# EAGLE design arpie_max (EAGLE 5.10)

## Sheet 1 of 5
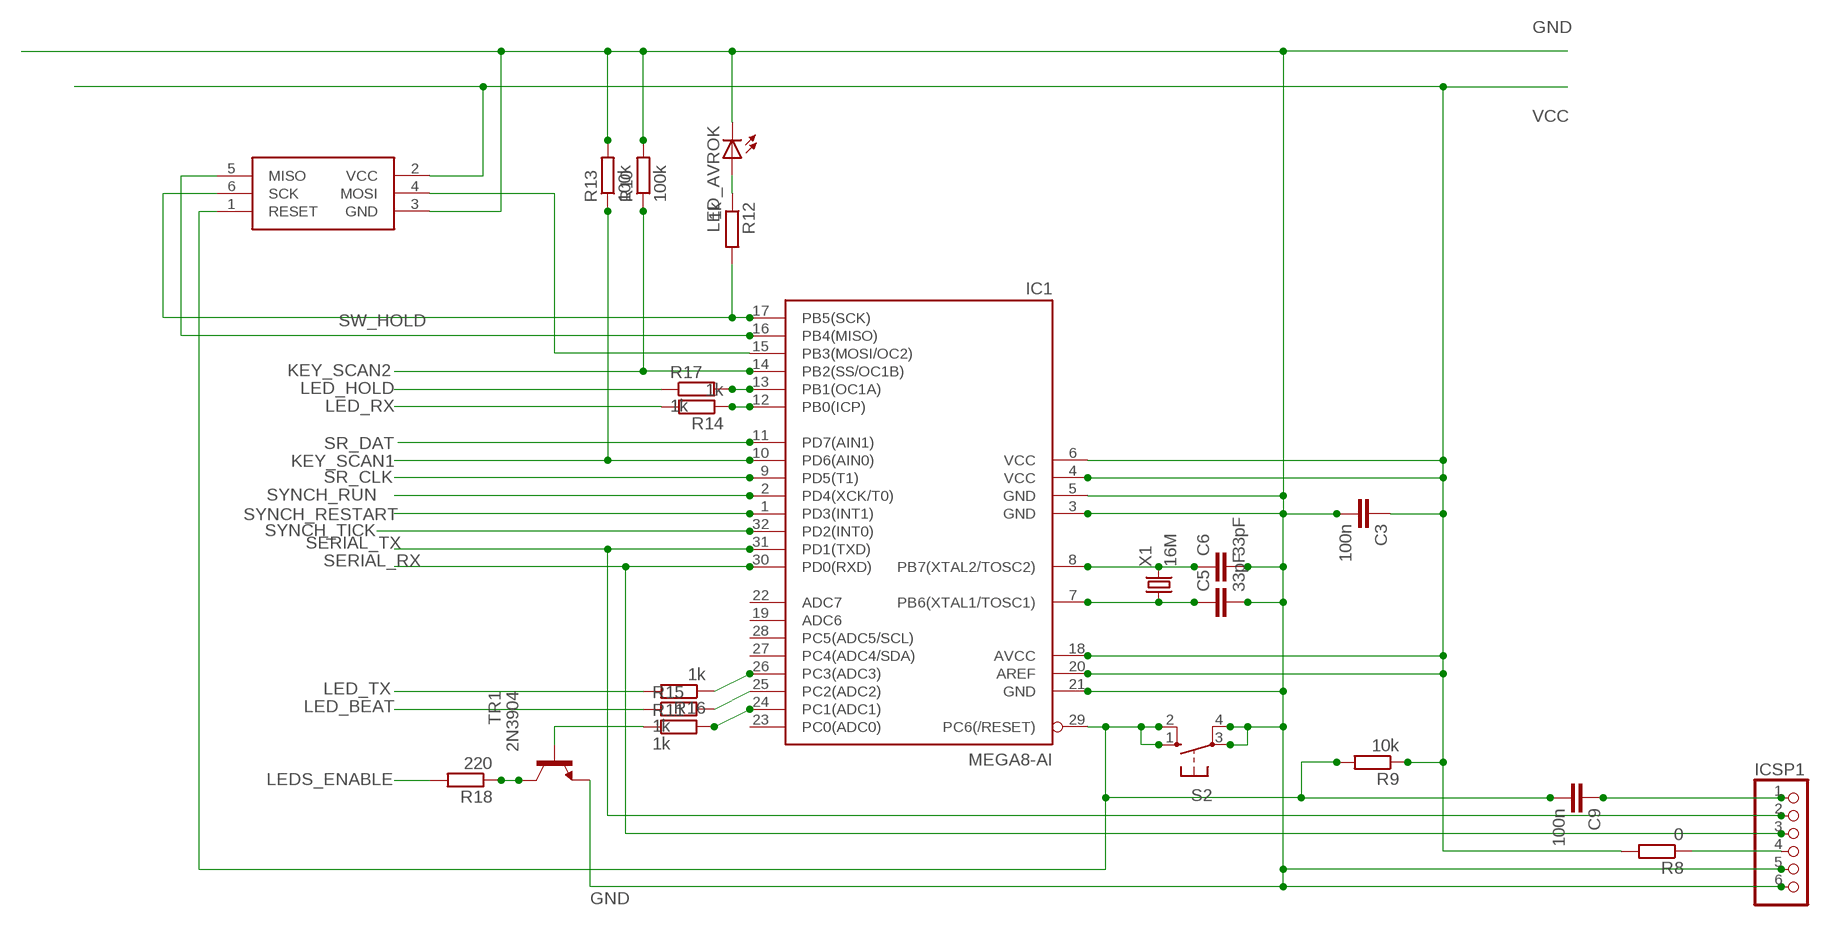
[diagram p0: schematic, sheet 1]

### Parts
C3  100n  C-EUC0805  [C0805]
C5  33pF  C-EUC0805  [C0805]
C6  33pF  C-EUC0805  [C0805]
C9  100n  C-EUC0805  [C0805]
IC1  MEGA8-AI  [TQFP32-08]
ICSP1  PINHD-1X6  [1X06]
LED_AVROK  LED3MM  [LED3MM]
R8  0  R-EU_R0805  [R0805]
R9  10k  R-EU_R0805  [R0805]
R10  100k  R-EU_R0805  [R0805]
R11  1k  R-EU_R0805  [R0805]
R12  1k  R-EU_R0805  [R0805]
R13  100k  R-EU_R0805  [R0805]
R14  1k  R-EU_R0805  [R0805]
R15  1k  R-EU_R0805  [R0805]
R16  1k  R-EU_R0805  [R0805]
R17  1k  R-EU_R0805  [R0805]
R18  220  R-EU_R0805  [R0805]
S2  10-XX  [B3F-10XX]
TR1  2N3904  MMBT3904LT1-NPN-SOT23-BEC  [SOT23-BEC]
U$1  TAG_CONN_AVR  [TC2030-MCP-NL]
X1  16M  CRYSTALHC49S  [HC49/S]

### Nets
GND: C3.2 C5.2 C6.2 IC1.3(GND) IC1.5(GND) IC1.21(GND) ICSP1.5 ICSP1.6 LED_AVROK.K(C) R10.2 R13.2 S2.3(P) S2.4(P1) TR1.E U$1.3(GND) ; also sheet 2,3,4,5
KEY_SCAN1: IC1.10(PD6(AIN0)) R13.1 ; also sheet 2
KEY_SCAN2: IC1.14(PB2(SS/OC1B)) R10.1 ; also sheet 2
LED_BEAT: R15.1 ; also sheet 2
LED_HOLD: R17.1 ; also sheet 2
LED_RX: R14.2 ; also sheet 2
LED_TX: R16.2 ; also sheet 2
LEDS_ENABLE: R18.2 ; also sheet 2
MOSI: IC1.15(PB3(MOSI/OC2)) U$1.4(MOSI)
N$4: R11.1 TR1.B
N$6: IC1.25(PC2(ADC2)) R15.2
N$9: C9.1 ICSP1.1
N$14: R18.1 TR1.C
N$15: ICSP1.4 R8.1
N$35: IC1.26(PC3(ADC3)) R16.1
N$36: C6.1 IC1.8(PB7(XTAL2/TOSC2)) X1.2
N$37: C5.1 IC1.7(PB6(XTAL1/TOSC1)) X1.1
N$38: C9.2 IC1.29(PC6(/RESET)) R9.2 S2.1(S) S2.2(S1) U$1.1(RESET)
N$43: IC1.24(PC1(ADC1)) R11.2
N$44: IC1.12(PB0(ICP)) R14.1
N$50: LED_AVROK.A R12.1
N$55: IC1.13(PB1(OC1A)) R17.2
SCK: IC1.17(PB5(SCK)) R12.2 U$1.6(SCK)
SERIAL_RX: IC1.30(PD0(RXD)) ICSP1.3 ; also sheet 5
SERIAL_TX: IC1.31(PD1(TXD)) ICSP1.2 ; also sheet 5
SR_CLK: IC1.9(PD5(T1)) ; also sheet 2
SR_DAT: IC1.11(PD7(AIN1)) ; also sheet 2
SW_HOLD: IC1.16(PB4(MISO)) U$1.5(MISO) ; also sheet 2
SYNCH_RESTART: IC1.1(PD3(INT1)) ; also sheet 3
SYNCH_RUN: IC1.2(PD4(XCK/T0)) ; also sheet 3
SYNCH_TICK: IC1.32(PD2(INT0)) ; also sheet 3
VCC: C3.1 IC1.4(VCC) IC1.6(VCC) IC1.18(AVCC) IC1.20(AREF) R8.2 R9.1 U$1.2(VCC) ; also sheet 2,3,4,5
Unconnected: IC1.19(ADC6) IC1.22(ADC7) IC1.23(PC0(ADC0)) IC1.27(PC4(ADC4/SDA)) IC1.28(PC5(ADC5/SCL))

## Sheet 2 of 5
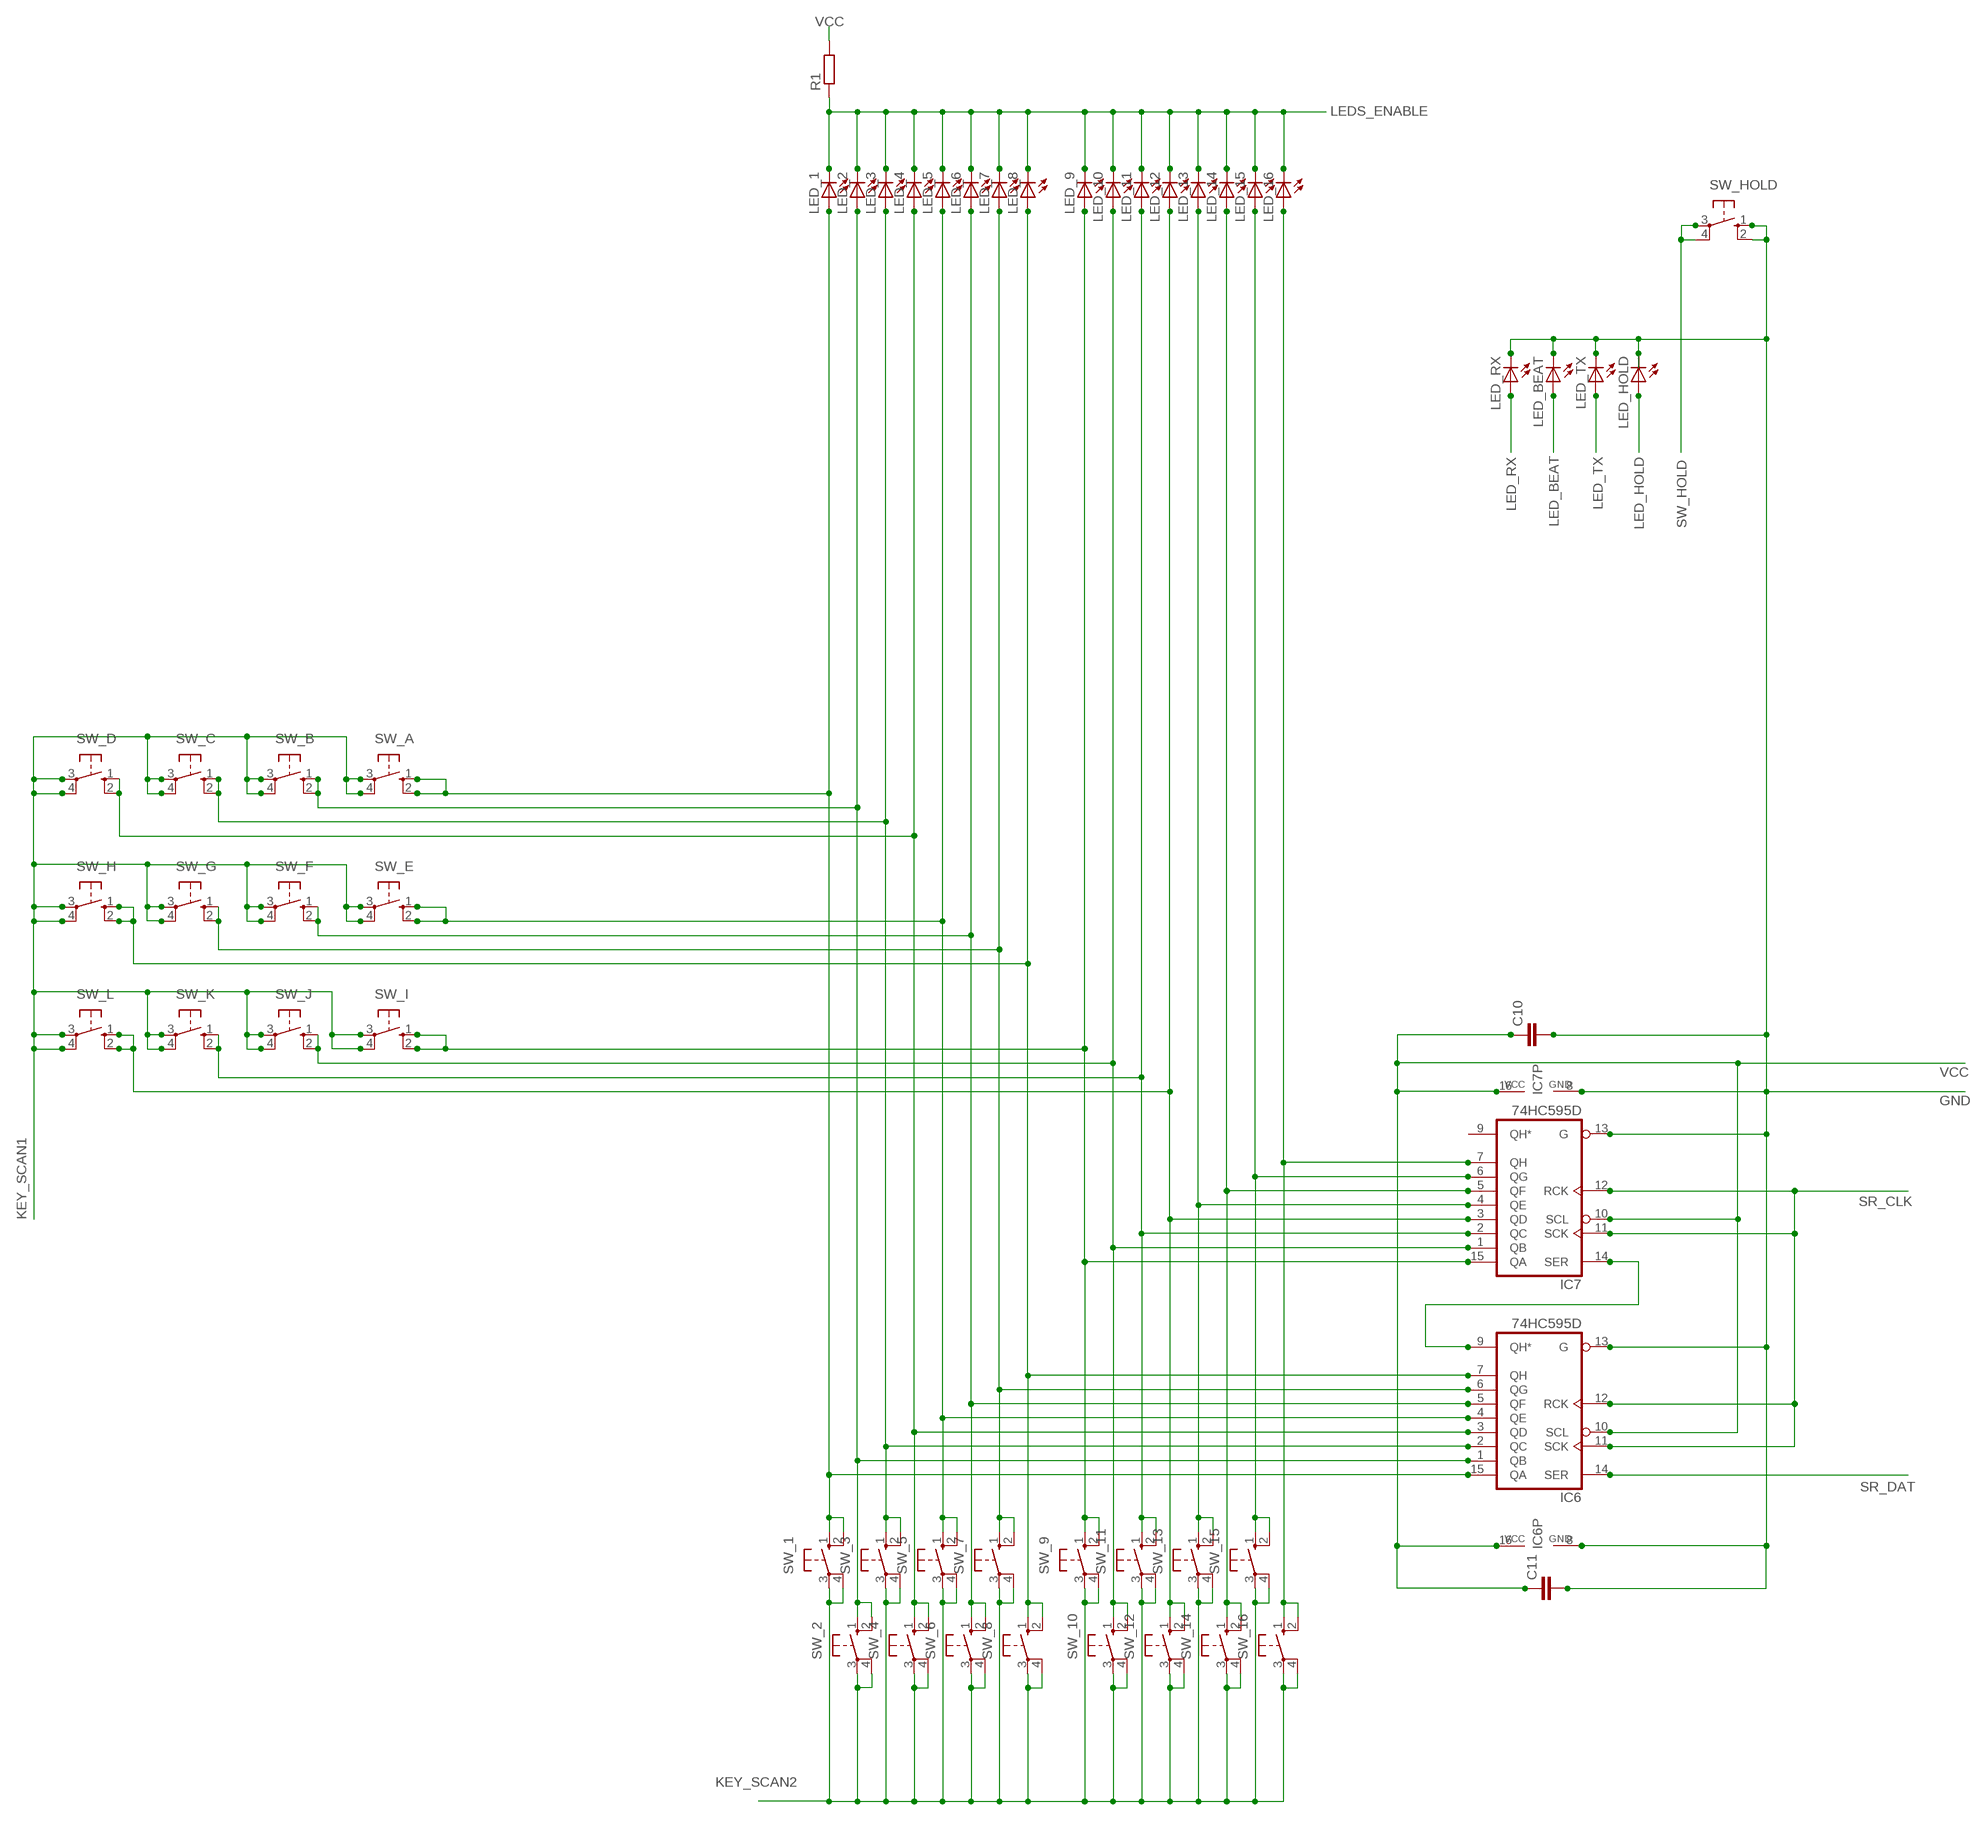
[diagram p1: schematic, sheet 2]

### Parts
C10  C-EUC0805  [C0805]
C11  C-EUC0805  [C0805]
IC6  74HC595D  [SO16]
IC7  74HC595D  [SO16]
LED_1  LED3MM  [LED3MM]
LED_2  LED3MM  [LED3MM]
LED_3  LED3MM  [LED3MM]
LED_4  LED3MM  [LED3MM]
LED_5  LED3MM  [LED3MM]
LED_6  LED3MM  [LED3MM]
LED_7  LED3MM  [LED3MM]
LED_8  LED3MM  [LED3MM]
LED_9  LED3MM  [LED3MM]
LED_10  LED3MM  [LED3MM]
LED_11  LED3MM  [LED3MM]
LED_12  LED3MM  [LED3MM]
LED_13  LED3MM  [LED3MM]
LED_14  LED3MM  [LED3MM]
LED_15  LED3MM  [LED3MM]
LED_16  LED3MM  [LED3MM]
LED_BEAT  LED3MM  [LED3MM]
LED_HOLD  LED3MM  [LED3MM]
LED_RX  LED3MM  [LED3MM]
LED_TX  LED3MM  [LED3MM]
R1  R-EU_R0805  [R0805]
SW_1  10-XX  [B3F-10XX]
SW_2  10-XX  [B3F-10XX]
SW_3  10-XX  [B3F-10XX]
SW_4  10-XX  [B3F-10XX]
SW_5  10-XX  [B3F-10XX]
SW_6  10-XX  [B3F-10XX]
SW_7  10-XX  [B3F-10XX]
SW_8  10-XX  [B3F-10XX]
SW_9  10-XX  [B3F-10XX]
SW_10  10-XX  [B3F-10XX]
SW_11  10-XX  [B3F-10XX]
SW_12  10-XX  [B3F-10XX]
SW_13  10-XX  [B3F-10XX]
SW_14  10-XX  [B3F-10XX]
SW_15  10-XX  [B3F-10XX]
SW_16  10-XX  [B3F-10XX]
SW_A  40-XX  [B3F-40XX]
SW_B  40-XX  [B3F-40XX]
SW_C  40-XX  [B3F-40XX]
SW_D  40-XX  [B3F-40XX]
SW_E  40-XX  [B3F-40XX]
SW_F  40-XX  [B3F-40XX]
SW_G  40-XX  [B3F-40XX]
SW_H  40-XX  [B3F-40XX]
SW_HOLD  40-XX  [B3F-40XX]
SW_I  40-XX  [B3F-40XX]
SW_J  40-XX  [B3F-40XX]
SW_K  40-XX  [B3F-40XX]
SW_L  40-XX  [B3F-40XX]

### Nets
GND: C10.2 C11.2 IC6.8(GND) IC6.13(G) IC7.8(GND) IC7.13(G) LED_BEAT.K(C) LED_HOLD.K(C) LED_RX.K(C) LED_TX.K(C) SW_HOLD.1(S) SW_HOLD.2(S1) ; also sheet 1,3,4,5
KEY_SCAN1: SW_A.3(P) SW_A.4(P1) SW_B.3(P) SW_B.4(P1) SW_C.3(P) SW_C.4(P1) SW_D.3(P) SW_D.4(P1) SW_E.3(P) SW_E.4(P1) SW_F.3(P) SW_F.4(P1) SW_G.3(P) SW_G.4(P1) SW_H.3(P) SW_H.4(P1) SW_I.3(P) SW_I.4(P1) SW_J.3(P) SW_J.4(P1) SW_K.3(P) SW_K.4(P1) SW_L.3(P) SW_L.4(P1) ; also sheet 1
KEY_SCAN2: SW_1.3(P) SW_1.4(P1) SW_2.3(P) SW_2.4(P1) SW_3.3(P) SW_3.4(P1) SW_4.3(P) SW_4.4(P1) SW_5.3(P) SW_5.4(P1) SW_6.3(P) SW_6.4(P1) SW_7.3(P) SW_7.4(P1) SW_8.3(P) SW_8.4(P1) SW_9.3(P) SW_9.4(P1) SW_10.3(P) SW_10.4(P1) SW_11.3(P) SW_11.4(P1) SW_12.3(P) SW_12.4(P1) SW_13.3(P) SW_13.4(P1) SW_14.3(P) SW_14.4(P1) SW_15.3(P) SW_15.4(P1) SW_16.3(P) SW_16.4(P1) ; also sheet 1
LED_BEAT: LED_BEAT.A ; also sheet 1
LED_HOLD: LED_HOLD.A ; also sheet 1
LED_RX: LED_RX.A ; also sheet 1
LED_TX: LED_TX.A ; also sheet 1
LEDS_ENABLE: LED_1.K(C) LED_2.K(C) LED_3.K(C) LED_4.K(C) LED_5.K(C) LED_6.K(C) LED_7.K(C) LED_8.K(C) LED_9.K(C) LED_10.K(C) LED_11.K(C) LED_12.K(C) LED_13.K(C) LED_14.K(C) LED_15.K(C) LED_16.K(C) R1.1 ; also sheet 1
N$17: IC6.15(QA) LED_1.A SW_1.1(S) SW_1.2(S1) SW_A.1(S) SW_A.2(S1)
N$20: IC6.1(QB) LED_2.A SW_2.1(S) SW_2.2(S1) SW_B.1(S) SW_B.2(S1)
N$21: IC6.2(QC) LED_3.A SW_3.1(S) SW_3.2(S1) SW_C.1(S) SW_C.2(S1)
N$22: IC6.3(QD) LED_4.A SW_4.1(S) SW_4.2(S1) SW_D.1(S) SW_D.2(S1)
N$23: IC6.4(QE) LED_5.A SW_5.1(S) SW_5.2(S1) SW_E.1(S) SW_E.2(S1)
N$24: IC6.5(QF) LED_6.A SW_6.1(S) SW_6.2(S1) SW_F.1(S) SW_F.2(S1)
N$25: IC6.6(QG) LED_7.A SW_7.1(S) SW_7.2(S1) SW_G.1(S) SW_G.2(S1)
N$26: IC6.7(QH) LED_8.A SW_8.1(S) SW_8.2(S1) SW_H.1(S) SW_H.2(S1)
N$27: IC7.15(QA) LED_9.A SW_9.1(S) SW_9.2(S1) SW_I.1(S) SW_I.2(S1)
N$28: IC7.1(QB) LED_10.A SW_10.1(S) SW_10.2(S1) SW_J.1(S) SW_J.2(S1)
N$29: IC7.3(QD) LED_12.A SW_12.1(S) SW_12.2(S1) SW_L.1(S) SW_L.2(S1)
N$30: IC7.2(QC) LED_11.A SW_11.1(S) SW_11.2(S1) SW_K.1(S) SW_K.2(S1)
N$31: IC6.9(QH*) IC7.14(SER)
N$32: IC7.4(QE) LED_13.A SW_13.1(S) SW_13.2(S1)
N$34: IC7.5(QF) LED_14.A SW_14.1(S) SW_14.2(S1)
N$39: IC7.6(QG) LED_15.A SW_15.1(S) SW_15.2(S1)
N$40: IC7.7(QH) LED_16.A SW_16.1(S) SW_16.2(S1)
SR_CLK: IC6.11(SCK) IC6.12(RCK) IC7.11(SCK) IC7.12(RCK) ; also sheet 1
SR_DAT: IC6.14(SER) ; also sheet 1
SW_HOLD: SW_HOLD.3(P) SW_HOLD.4(P1) ; also sheet 1
VCC: C10.1 C11.1 IC6.10(SCL) IC6.16(VCC) IC7.10(SCL) IC7.16(VCC) R1.2 ; also sheet 1,3,4,5
Unconnected: IC7.9(QH*)

## Sheet 3 of 5
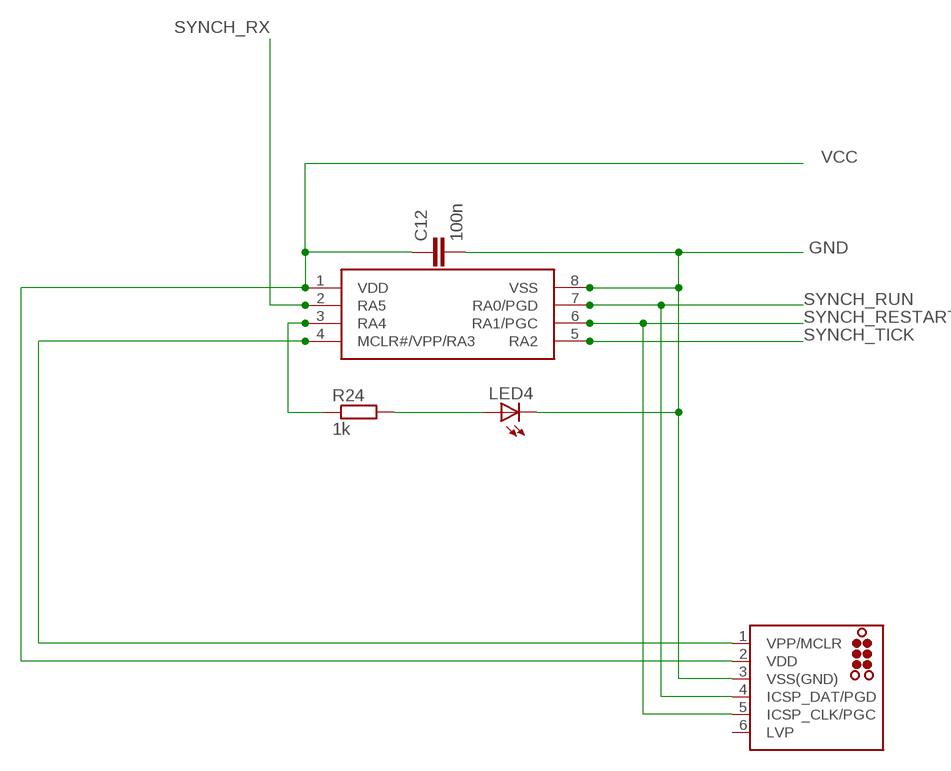
[diagram p2: schematic, sheet 3]

### Parts
C12  100n  C-EUC0805  [C0805]
IC9  PIC12F1822SO08  [SO08]
J1  TC2030-MCP-NL  [TC2030-MCP-NL]
LED4  LED3MM  [LED3MM]
R24  1k  R-EU_R0805  [R0805]

### Nets
GND: C12.2 IC9.8(VSS) J1.3(VSS(GND)) LED4.K(C) ; also sheet 1,2,4,5
N$1: LED4.A R24.2
N$58: IC9.3(RA4) R24.1
N$59: IC9.4(MCLR#/VPP/RA3) J1.1(VPP/MCLR)
SYNCH_RESTART: IC9.6(RA1/PGC) J1.5(ICSP_CLK/PGC) ; also sheet 1
SYNCH_RUN: IC9.7(RA0/PGD) J1.4(ICSP_DAT/PGD) ; also sheet 1
SYNCH_RX: IC9.2(RA5) ; also sheet 5
SYNCH_TICK: IC9.5(RA2) ; also sheet 1
VCC: C12.1 IC9.1(VDD) J1.2(VDD) ; also sheet 1,2,4,5
Unconnected: J1.6(LVP)

## Sheet 4 of 5
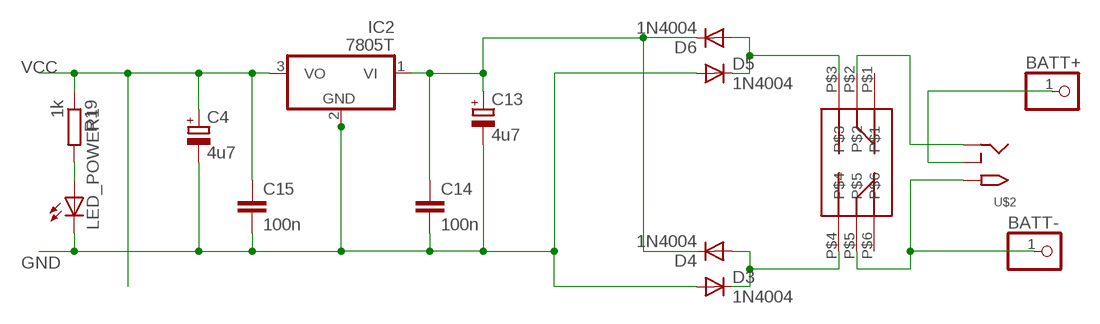
[diagram p3: schematic, sheet 4]

### Parts
BATT+  PINHD-1X1  [1X01]
BATT-  PINHD-1X1  [1X01]
C4  4u7  CPOL-EUE2-5  [E2-5]
C13  4u7  CPOL-EUE2-5  [E2-5]
C14  100n  C-EUC0805  [C0805]
C15  100n  C-EUC0805  [C0805]
D3  1N4004  [DO-VERT]
D4  1N4004  [DO-VERT]
D5  1N4004  [DO-VERT]
D6  1N4004  [DO-VERT]
IC2  7805T  [TO220H]
LED_POWER1  LED3MM  [LED3MM]
R19  1k  R-EU_R0805  [R0805]
U$2  2.1MMJACKTHM  [PJ-102A]
U$3  2P2T_LATCHING  [2P2T_LATCHING]

### Nets
GND: C4.- C13.- C14.2 C15.2 D3.A D5.A IC2.2(GND) LED_POWER1.K(C) ; also sheet 1,2,3,5
N$5: U$2.RING U$3.P$2
N$10: BATT-.1 U$2.TIP U$3.P$5
N$19: BATT+.1 U$2.RING_SW
N$33: LED_POWER1.A R19.2
N$41: D3.C D4.A U$3.P$4
N$45: D5.C D6.A U$3.P$3
VCC: C4.+ C15.1 IC2.3(VO) R19.1 ; also sheet 1,2,3,5
VIN1: C13.+ C14.1 D4.C D6.C IC2.1(VI)
Unconnected: U$3.P$1 U$3.P$6

## Sheet 5 of 5
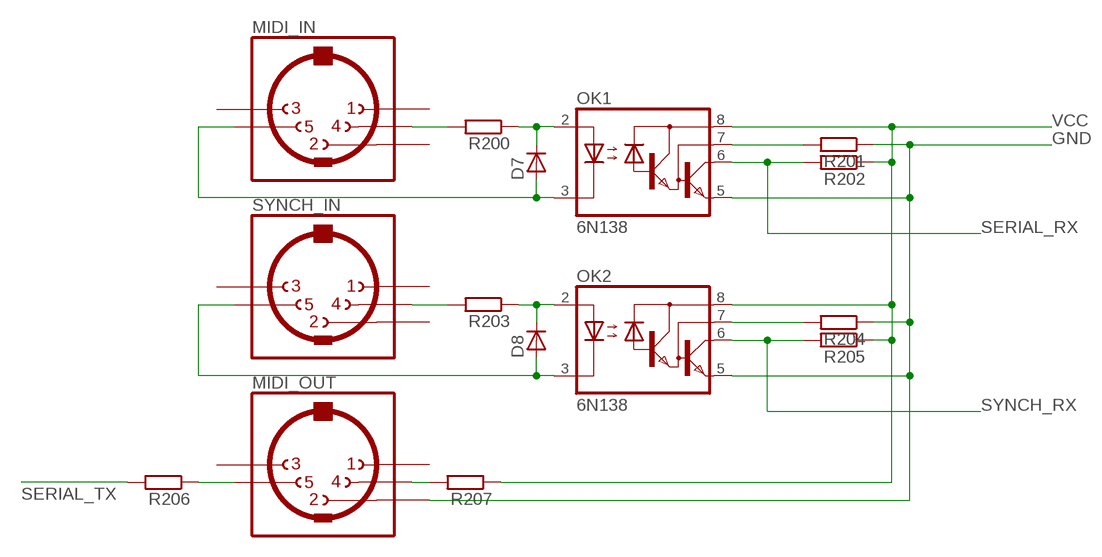
[diagram p4: schematic, sheet 5]

### Parts
D7  D-MLL-34  [MELF-MLL34]
D8  D-MLL-34  [MELF-MLL34]
MIDI_IN  DIN5PINRAPIDDIN5  [RAPIDDIN5]
MIDI_OUT  DIN5PINRAPIDDIN5  [RAPIDDIN5]
OK1  6N138  [DIL08]
OK2  6N138  [DIL08]
R200  R-EU_R0805  [R0805]
R201  R-EU_R0805  [R0805]
R202  R-EU_R0805  [R0805]
R203  R-EU_R0805  [R0805]
R204  R-EU_R0805  [R0805]
R205  R-EU_R0805  [R0805]
R206  R-EU_R0805  [R0805]
R207  R-EU_R0805  [R0805]
SYNCH_IN  DIN5PINRAPIDDIN5  [RAPIDDIN5]

### Nets
GND: MIDI_OUT.2 OK1.5(GND) OK2.5(GND) R201.1 R204.1 ; also sheet 1,2,3,4
N$46: MIDI_OUT.4 R207.2
N$47: OK1.7(VB) R201.2
N$48: MIDI_OUT.5 R206.1
N$49: OK2.7(VB) R204.2
N$56: D8.1(C) OK2.2(A) R203.1
N$57: D8.2(A) OK2.3(C) SYNCH_IN.5
N$60: D7.2(A) MIDI_IN.5 OK1.3(C)
N$61: D7.1(C) OK1.2(A) R200.1
N$62: MIDI_IN.4 R200.2
N$63: R203.2 SYNCH_IN.4
SERIAL_RX: OK1.6(VO) R202.2 ; also sheet 1
SERIAL_TX: R206.2 ; also sheet 1
SYNCH_RX: OK2.6(VO) R205.2 ; also sheet 3
VCC: OK1.8(VCC) OK2.8(VCC) R202.1 R205.1 R207.1 ; also sheet 1,2,3,4
Unconnected: MIDI_IN.1 MIDI_IN.2 MIDI_IN.3 MIDI_OUT.1 MIDI_OUT.3 SYNCH_IN.1 SYNCH_IN.2 SYNCH_IN.3

## Library data of the parts
BATT+ BATT- = adafruit:PINHD-1X1: Pin header 1x1 for 0.1" spacing With round pins
C3 C5 C6 C9-C12 C14 C15 = rcl:C-EU: CAPACITOR, European symbol
C4 C13 = rcl:CPOL-EU: POLARIZED CAPACITOR, European symbol
D3-D6 = jasons_stuff:1N4004: DIODE general purpose rectifier, 1 A
D7 D8 = semicon-smd-ipc:D-: DIODE unfilled
IC1 = atmel:MEGA8: MICROCONTROLLER 8 Kbytes FLASH, 1 kbytes SRAM, 512 bytes EEPROM, USART, 6-channel 10 bit ADC, 2-channel 8 bit ADC Pin compatible with Atmega48, ATMega88, ATMega168 Source: avr.lbr
IC2 = linear:78*: Positive VOLTAGE REGULATOR Source: http://cache.national.com/ds/LM/LM78L05.pdf http://www.fairchildsemi.com/ds/LM/LM7805.pdf
IC6 IC7 = 74xx-eu:74*595: 8-bit SHIFT REGISTER, output latch
IC9 = jasons_stuff:PIC12F1822
ICSP1 = adafruit:PINHD-1X6: PIN HEADER
J1 = tag-connect:TC2030: TAG-CONNECT ICSP Connector Manufacturer: Tag-Connect <http://www.tag-connect.com> Cable for easy In-Circuit Serial Programming. Designed for Microchip ICD2, suitable for many others. Two variants - one "with legs" (for hands-free fit on PCB) and another "without legs" for quick programming. PAD Description 1 MCLR/Vpp 2 Vdd 3 GND 4 PGD (ISPDAT) 5 PGC (ISPCLK) 6 nc (used for LVP) ©2009 ROFA.cz - modified and updated by Robert Darlington ‹rdarlington@gmail.com›
LED4 LED_1-LED_16 LED_AVROK LED_BEAT LED_HOLD LED_POWER1 LED_RX LED_TX = adafruit:LED: LED OSRAM: - CHIPLED LG R971, LG N971, LY N971, LG Q971, LY Q971, LO R971, LY R971 LH N974, LH R974 LS Q976, LO Q976, LY Q976 LO Q996 - Hyper CHIPLED LW Q18S LB Q993, LB Q99A, LB R99A - SideLED LS A670, LO A670, LY A670, LG A670, LP A670 LB A673, LV A673, LT A673, LW A673 LH A674 LY A675 LS A676, LA A676, LO A676, LY A676, LW A676 LS A679, LY A679, LG A679 - Hyper Micro SIDELED® LS Y876, LA Y876, LO Y876, LY Y876 LT Y87S - SmartLED LW L88C, LW L88S LB L89C, LB L89S, LG L890 LS L89K, LO L89K, LY L89K LS L896, LA L896, LO L896, LY L896 - TOPLED LS T670, LO T670, LY T670, LG T670, LP T670 LSG T670, LSP T670, LSY T670, LOP T670, LYG T670 LG T671, LOG T671, LSG T671 LB T673, LV T673, LT T673, LW T673 LH T674 LS T676, LA T676, LO T676, LY T676, LB T676, LH T676, LSB T676, LW T676 LB T67C, LV T67C, LT T67C, LS T67K, LO T67K, LY T67K, LW E67C LS E67B, LA E67B, LO E67B, LY E67B, LB E67C, LV E67C, LT E67C LW T67C LS T679, LY T679, LG T679 LS T770, LO T770, LY T770, LG T770, LP T770 LB T773, LV T773, LT T773, LW T773 LH T774 LS E675, LA E675, LY E675, LS T675 LS T776, LA T776, LO T776, LY T776, LB T776 LHGB T686 LT T68C, LB T68C - Hyper Mini TOPLED® LB M676 - Mini TOPLED Santana® LG M470 LS M47K, LO M47K, LY M47K Source: http://www.osram.convergy.de/
MIDI_IN MIDI_OUT SYNCH_IN = jasons_stuff:DIN5PIN: Female CONNECTOR 5 pins 90 deg. with shield, horizontal (DIN 41524)
OK1 OK2 = optocoupler:6N138: MOTOROLA OPTO COUPLER
R1 R8-R19 R24 = resistor:R-EU_: RESISTOR, European symbol
R200-R207 = rcl:R-EU_: RESISTOR, European symbol
S2 SW_1-SW_16 = switch-omron:10-XX: OMRON SWITCH
SW_A SW_B SW_C SW_D SW_E SW_F SW_G SW_H SW_HOLD SW_I SW_J SW_K SW_L = switch-omron:40-XX: OMRON SWITCH
TR1 = transistor:*-NPN-: NPN Transistror BF959 corrected 2008.03.06
U$1 = jasons_stuff:TAG_CONN_AVR
U$2 = adafruit:2.1MMJACK: 2.1mm x 5.5mm THM DC jack with internal switch. Digikey part #PJ-102A, 4UCON part #05537 2.1mm x 5.5mm SMT DC jack with internal switch. Digikey part #PJ-002A-SMT, 4UCON part #03267 By microbuilder.eu & adafruit.com
U$3 = jasons_stuff:2P2T_LATCHING
X1 = crystal:CRYSTAL: CRYSTAL

## Board
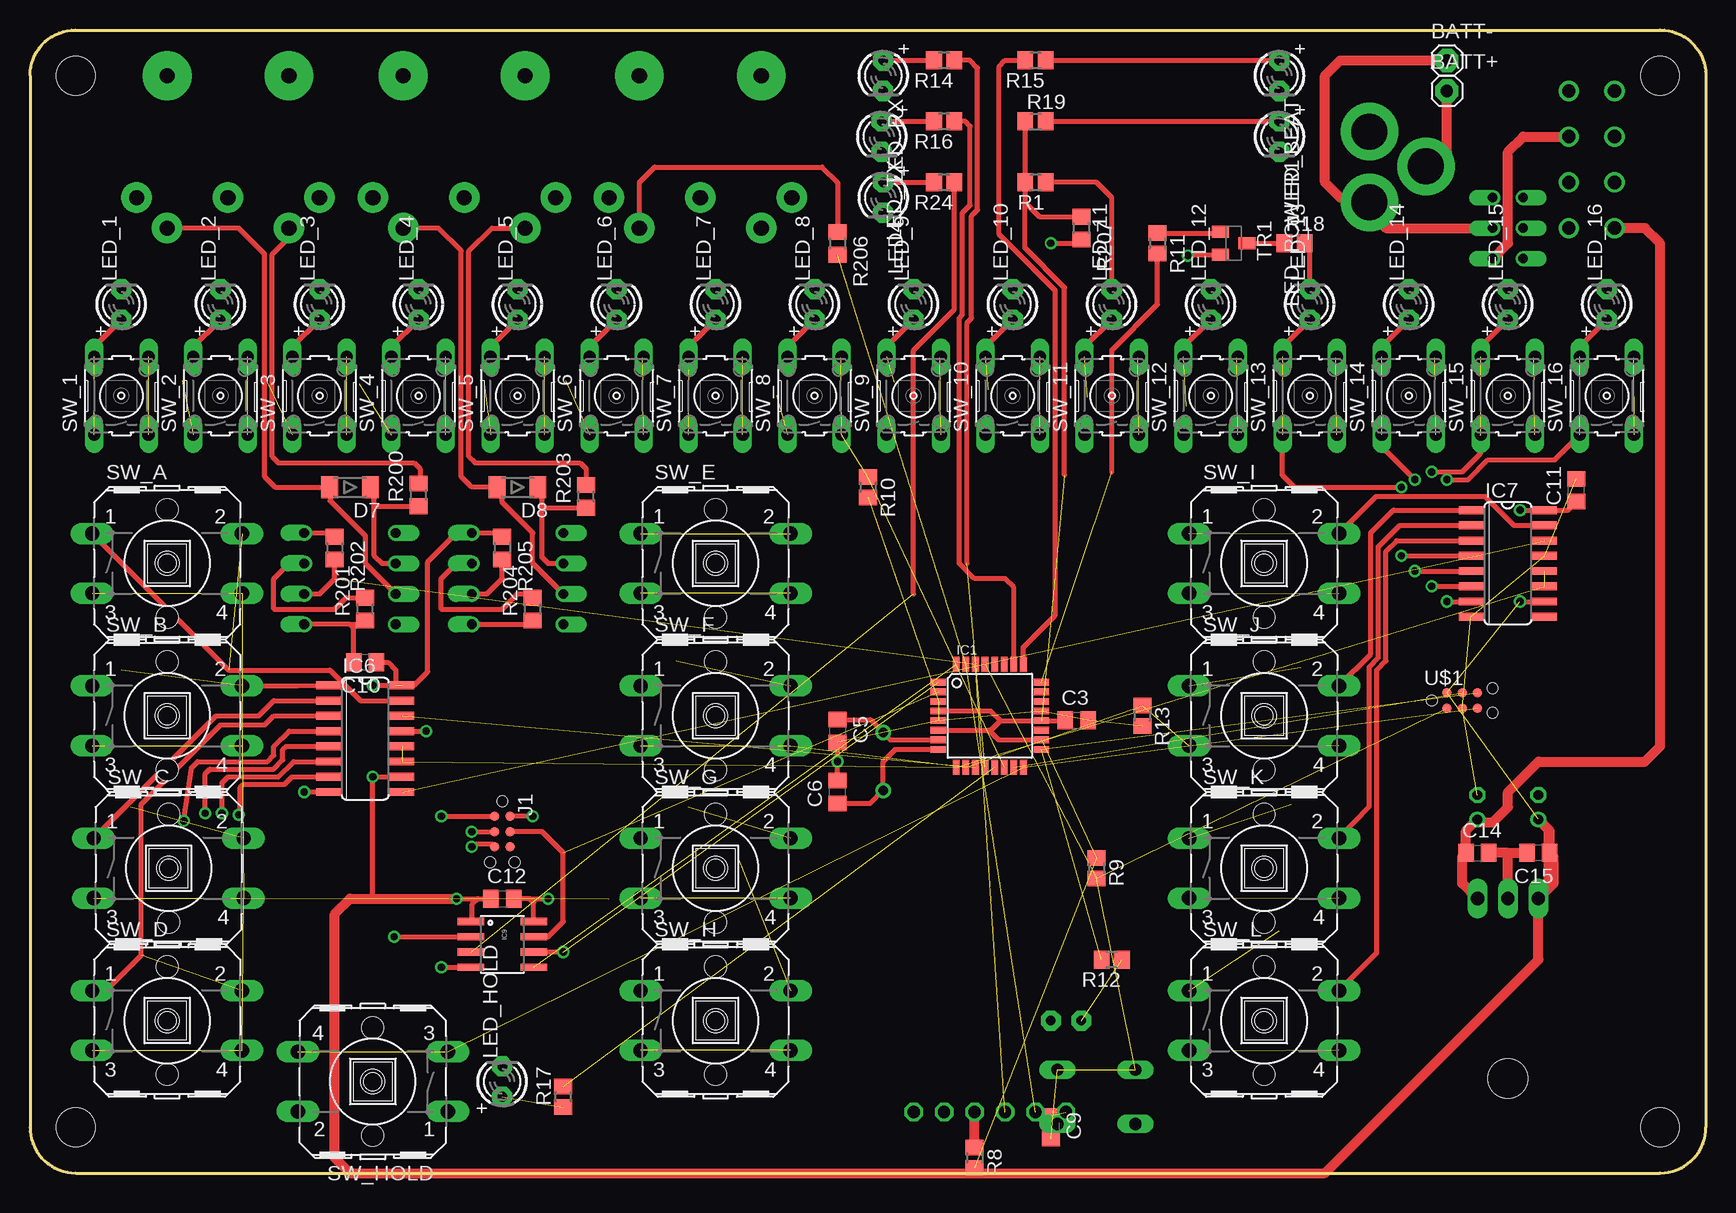
[diagram p5: board, top side]
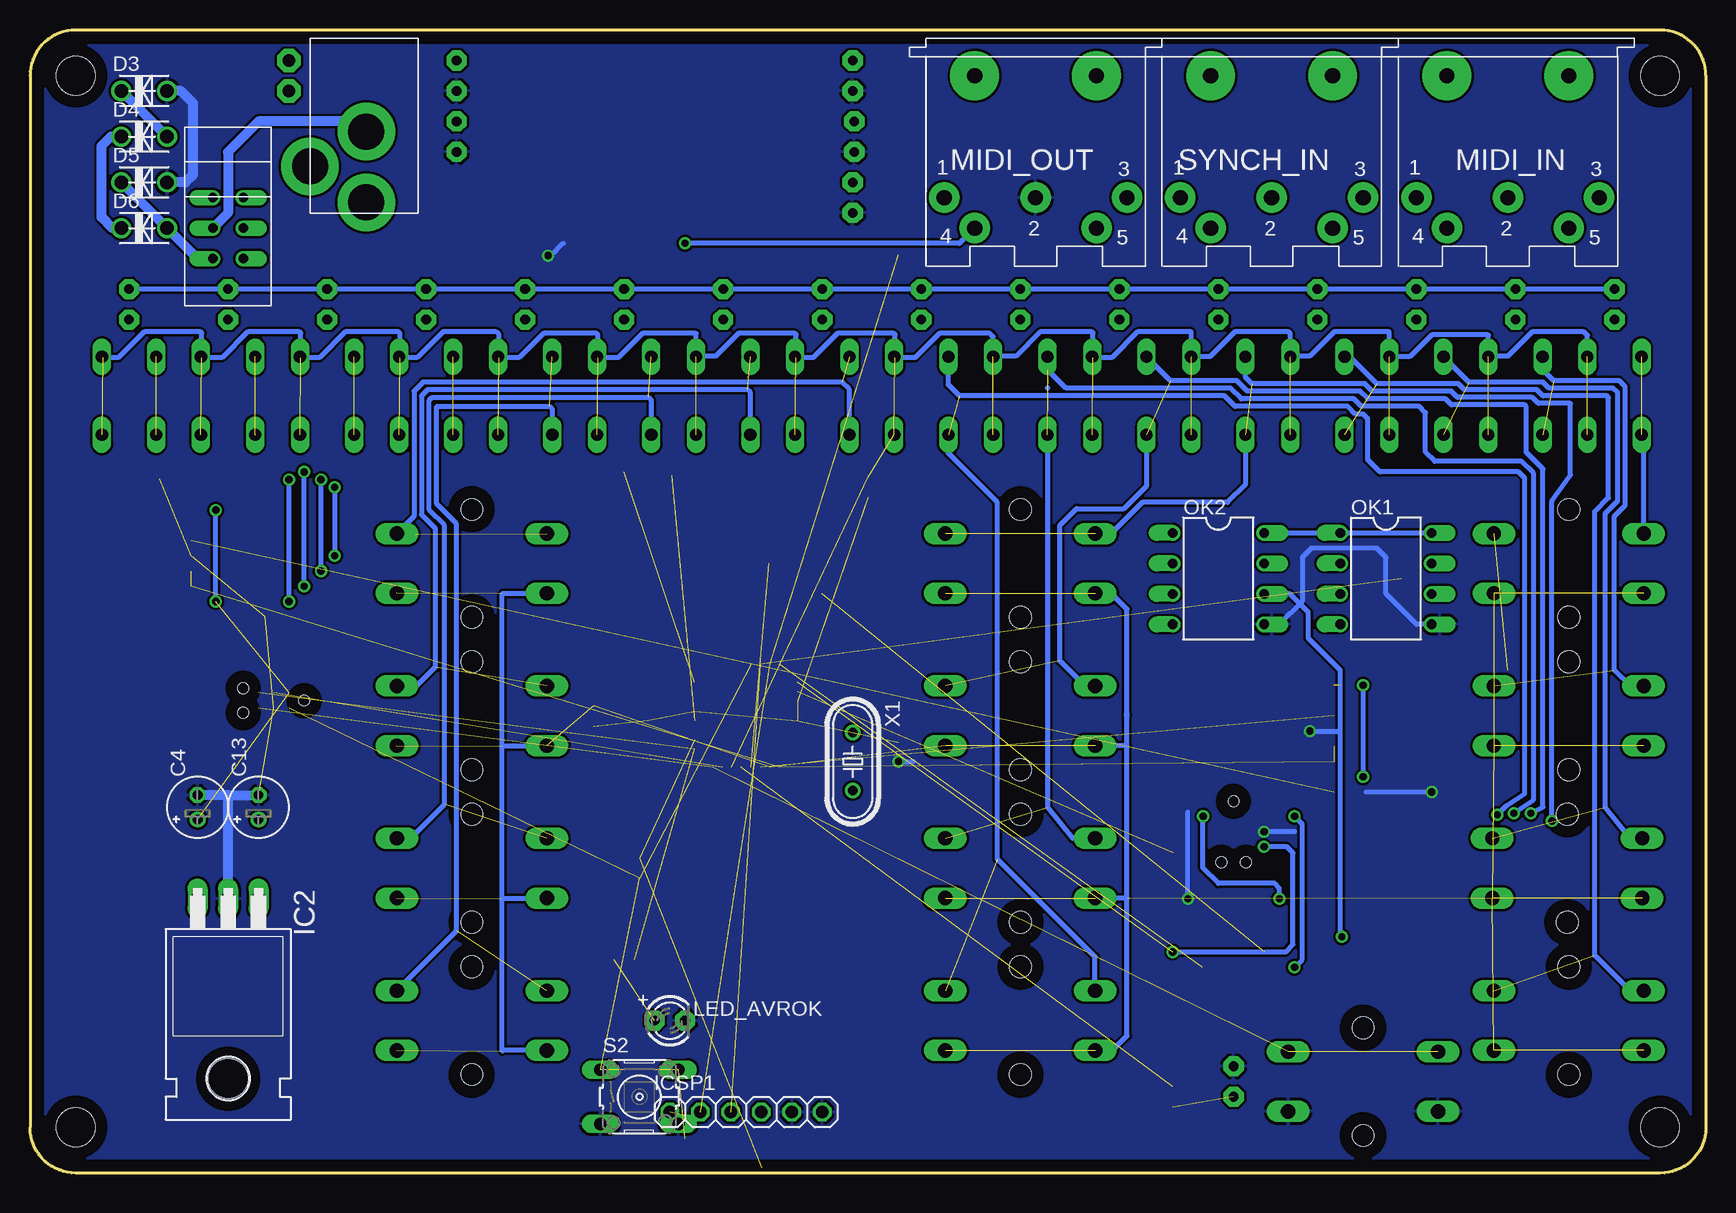
[diagram p6: board, bottom side, seen from below]

Size 139.7 x 95.25 mm. Coordinates in mm from the lower left corner, seen from the top.
Outline: 0,91.44 0,3.81 arc90 3.81,0 135.89,0 arc90 139.7,3.81 139.7,91.44 arc90 135.89,95.25 3.81,95.25 arc90 0,91.44
Copper layers (1*16): Top 0.035mm / dielectric 1.5mm / Bottom 0.035mm
Design rules "default": minimum track width 10mil, minimum drill 24mil, track to track 8mil, track to pad 8mil, pad to pad 8mil, via to via 8mil, smd to smd 8mil, copper to edge 40mil, drill to drill 8mil, minimum pad ring 10mil, minimum via ring 8mil, stop-mask expansion 4mil, vias tented up to drill 0mil, thermal gap 10mil
Holes 3.2 mm at 3.81,91.44 3.81,3.81 135.89,91.44 135.89,3.81

### Footprints (pad centres in the part's own frame; a part is rotated, then mirrored left to right if it is on the bottom)
1X01 = drill 1.016 pad 1.93 octagon: 1 0,0
C0805 = smd 1.3 x 1.5: 1 -0.95,0; 2 0.95,0
E2-5 = drill 0.813 pad 1.27 round: + -1.016,0 | drill 0.813 pad 1.27 octagon: - 1.016,0
DO-VERT = drill 1.118 round: A 2.54,0; C -1.27,0
MELF-MLL34 = smd 1.4 x 1.8: 1 -1.7,0; 2 1.7,0
TQFP32-08 = smd 1.27 x 0.559: 1 -4.293,2.8; 2 -4.293,2; 3 -4.293,1.2; 4 -4.293,0.4; 5 -4.293,-0.4; 6 -4.293,-1.2; 7 -4.293,-2; 8 -4.293,-2.8; 17 4.293,-2.8; 18 4.293,-2; 19 4.293,-1.2; 20 4.293,-0.4; 21 4.293,0.4; 22 4.293,1.2; 23 4.293,2; 24 4.293,2.8 | smd 0.559 x 1.27: 9 -2.8,-4.293; 10 -2,-4.293; 11 -1.2,-4.293; 12 -0.4,-4.293; 13 0.4,-4.293; 14 1.2,-4.293; 15 2,-4.293; 16 2.8,-4.293; 25 2.8,4.293; 26 2,4.293; 27 1.2,4.293; 28 0.4,4.293; 29 -0.4,4.293; 30 -1.2,4.293; 31 -2,4.293; 32 -2.8,4.293
TO220H = drill 1.118 long: 1 -2.54,-10.16; 2 0,-10.16; 3 2.54,-10.16 | hole 3.302: 0,4.826
SO16 = smd 0.66 x 2.032: 1 -4.445,-3.073; 2 -3.175,-3.073; 3 -1.905,-3.073; 4 -0.635,-3.073; 5 0.635,-3.073; 6 1.905,-3.073; 7 3.175,-3.073; 8 4.445,-3.073; 9 4.445,3.073; 10 3.175,3.073; 11 1.905,3.073; 12 0.635,3.073; 13 -0.635,3.073; 14 -1.905,3.073; 15 -3.175,3.073; 16 -4.445,3.073
SO08 = smd 0.61 x 2.21: 1 -1.905,-2.616; 2 -0.635,-2.616; 3 0.635,-2.616; 4 1.905,-2.616; 5 1.905,2.616; 6 0.635,2.616; 7 -0.635,2.616; 8 -1.905,2.616
1X06 = drill 1.016 octagon: 1 -6.35,0; 2 -3.81,0; 3 -1.27,0; 4 1.27,0; 5 3.81,0; 6 6.35,0
TC2030-MCP-NL = smd 0.787 x 0.787: 1 1.27,-0.635; 2 1.27,0.635; 3 2.54,-0.635; 4 2.54,0.635; 5 3.81,-0.635; 6 3.81,0.635 | hole 0.889: 0,0; 5.08,-1.016; 5.08,1.016
LED3MM = drill 0.813 pad 1.676 octagon: A -1.27,0; K 1.27,0
RAPIDDIN5 = drill 1.27 pad 2.54 round: 1 7.62,5.08; 2 0,5.08; 3 -7.62,5.08; 4 5.08,7.62; 5 -5.08,7.62 | drill 1.27 pad 4.064 round: NC -5.08,-5.08; NC@ 5.08,-5.08
DIL08 = drill 0.813 offset: 1 -3.81,-3.81; 2 -1.27,-3.81; 3 1.27,-3.81; 4 3.81,-3.81; 5 3.81,3.81; 6 1.27,3.81; 7 -1.27,3.81; 8 -3.81,3.81
R0805 = smd 1.3 x 1.5: 1 -0.85,0; 2 0.85,0
R0805' = smd 1.3 x 1.5: 1 -0.95,0; 2 0.95,0
B3F-10XX = drill 1.016 long: 1 -3.251,2.261; 2 3.251,2.261; 3 -3.251,-2.261; 4 3.251,-2.261
B3F-40XX = drill 1.194 long: 1 -6.248,2.489; 2 6.248,2.489; 3 -6.248,-2.489; 4 6.248,-2.489 | hole 1.803: 0,-4.496; 0,4.496
SOT23-BEC = smd 1 x 1.4: B -0.95,-1.1; C 0,1.1; E 0.95,-1.1
PJ-102A = drill 3 pad 4.8 round: RING 0.1,-3.39; RING_SW -4.6,-6.29; TIP 0.1,-9.29
2P2T_LATCHING = drill 0.8 offset: P$1 -1.27,0; P$2 -1.27,-2.54; P$3 -1.27,-5.08; P$4 1.27,-5.08; P$5 1.27,-2.54; P$6 1.27,0
HC49/S = drill 0.813 round: 1 -2.413,0; 2 2.413,0

### Placement (x,y rotation side)
BATT+  118.11,90.17 0 top
BATT-  118.11,92.71 0 top
C3  87.25,37.72 0 top
C4  125.73,30.48 90 bottom
C5  67.31,36.83 270 top
C6  67.31,31.75 90 top
C9  85.09,3.81 270 top
C10  27.94,42.55 180 top
C11  128.91,56.9 90 top
C12  39.37,22.86 0 top
C13  120.65,30.48 90 bottom
C14  120.65,26.67 0 top
C15  125.73,26.67 180 top
D3  130.81,90.17 0 bottom
D4  130.81,86.36 0 bottom
D5  130.81,82.55 0 bottom
D6  130.81,78.74 0 bottom
D7  26.67,57.15 180 top
D8  40.64,57.15 180 top
IC1  80.01,38.1 0 top
IC2  123.19,12.7 180 bottom
IC6  27.94,36.2 270 top
IC7  123.19,50.8 270 top
IC9  39.37,19.05 270 top
ICSP1  80.01,5.08 0 bottom
J1  39.37,30.99 270 top
LED4  71.12,81.28 270 top
LED_1  7.62,72.39 90 top
LED_2  15.88,72.39 90 top
LED_3  24.13,72.39 90 top
LED_4  32.38,72.39 90 top
LED_5  40.64,72.39 90 top
LED_6  48.89,72.39 90 top
LED_7  57.15,72.39 90 top
LED_8  65.41,72.39 90 top
LED_9  73.66,72.39 90 top
LED_10  81.91,72.39 90 top
LED_11  90.17,72.39 90 top
LED_12  98.42,72.39 90 top
LED_13  106.68,72.39 90 top
LED_14  114.94,72.39 90 top
LED_15  123.19,72.39 90 top
LED_16  131.44,72.39 90 top
LED_AVROK  86.36,12.7 0 bottom
LED_BEAT  104.14,91.44 270 top
LED_HOLD  39.37,7.62 90 top
LED_POWER1  104.14,86.36 270 top
LED_RX  71.12,91.44 270 top
LED_TX  70.99,86.36 270 top
MIDI_IN  16.51,86.36 180 bottom
MIDI_OUT  55.88,86.36 180 bottom
OK1  26.67,49.53 270 bottom
OK2  40.64,49.53 270 bottom
R1  83.82,82.55 180 top
R8  78.74,1.27 270 top
R9  88.9,25.4 270 top
R10  69.85,57.15 270 top
R11  93.98,77.47 270 top
R12  90.17,17.78 180 top
R13  92.71,38.1 270 top
R14  76.2,92.71 180 top
R15  83.82,92.71 180 top
R16  76.2,87.63 180 top
R17  44.45,6.35 90 top
R18  105.41,77.47 0 top
R19  83.82,87.63 0 top
R24  76.2,82.55 180 top
R200  [R0805']  32.38,56.52 90 top
R201  [R0805']  27.94,46.99 90 top
R202  [R0805']  25.4,52.07 270 top
R203  [R0805']  46.35,56.39 90 top
R204  [R0805']  41.91,46.99 90 top
R205  [R0805']  39.37,52.07 270 top
R206  [R0805']  67.31,77.47 270 top
R207  [R0805']  87.63,78.74 270 top
S2  88.9,6.35 0 bottom
SW_1  7.62,64.77 90 top
SW_2  15.88,64.77 90 top
SW_3  24.13,64.77 90 top
SW_4  32.38,64.77 90 top
SW_5  40.64,64.77 90 top
SW_6  48.89,64.77 90 top
SW_7  57.15,64.77 90 top
SW_8  65.41,64.77 90 top
SW_9  73.66,64.77 90 top
SW_10  81.91,64.77 90 top
SW_11  90.17,64.77 90 top
SW_12  98.42,64.77 90 top
SW_13  106.68,64.77 90 top
SW_14  114.94,64.77 90 top
SW_15  123.19,64.77 90 top
SW_16  131.44,64.77 90 top
SW_A  11.43,50.8 0 top
SW_B  11.43,38.1 0 top
SW_C  11.56,25.4 0 top
SW_D  11.43,12.7 0 top
SW_E  57.15,50.8 0 top
SW_F  57.15,38.1 0 top
SW_G  57.15,25.4 0 top
SW_H  57.15,12.7 0 top
SW_HOLD  28.58,7.62 180 top
SW_I  102.87,50.8 0 top
SW_J  102.87,38.1 0 top
SW_K  102.87,25.4 0 top
SW_L  102.87,12.7 0 top
SYNCH_IN  36.2,86.36 180 bottom
TR1  100.33,77.47 270 top
U$1  116.84,39.37 0 top
U$2  111.76,90.17 0 bottom
U$3  123.19,81.28 0 bottom
X1  71.12,34.29 270 bottom

### Tracks (layer width: path | path; a pad name or v marks a point on that pad's centre or on a via)
GND  (via drill 0.6)  (10 unrouted)
  Top 0.406: R201.1 27.62,45.72 26.67,45.72 | R204.1 41.59,45.72 OK2.5 36.51,45.4 | IC9.8 41.99,22.53 41.66,22.86 | IC6.8 v22.86,31.75 | v36.83,28.45 J1.3 | 41.66,22.86 C12.2 | 41.66,22.86 v43.18,22.86 | 26.67,45.72 OK1.5 | C10.2 26.99,45.4 26.67,45.72 | TR1.E 96.59,76.52 v96.52,76.45 | IC6.13 v33.02,36.83 | C5.2 v67.31,34.29 C6.2
  Top 0.813: 123.19,26.67 C14.2 | 123.19,26.67 C15.2 | IC2.2 123.19,26.67
  Bottom 0.406: 34.29,28.45 v36.83,28.45 | v43.18,22.86 43.18,30.1 | v22.86,31.75 28.32,31.75 | OK1.5 24.13,45.72 26.67,48.26 26.67,51.31 27.43,52.07 32.89,52.07 33.66,51.31 33.66,47.62 35.56,45.72 OK2.5 | v96.52,76.45 96.27,76.45 95.25,77.47 | v33.02,36.83 30.48,36.83 | v67.31,34.29 66.04,34.29
  Bottom 0.813: D3.A 127.13,90.17 126.11,89.15 126.11,83.19 126.75,82.55 D5.A | 123.19,31.5 C13.- | 123.19,31.5 C4.- | IC2.2 123.19,31.5
  pour Bottom: 0,95.25 0,0 139.7,0 139.7,95.25
KEY_SCAN1  (19 unrouted)
  Bottom 0.406: SW_E.3 49.58,48.31 48.26,46.99 48.26,38.25 48.34,38.18 48.26,38.1 48.26,35.56 | 49.48,22.91 SW_G.3 48.31,22.91 48.26,22.86 | SW_H.3 49.48,10.21 48.26,11.43 48.26,22.86 | 48.26,22.86 48.26,35.56 | SW_F.3 48.31,35.61 48.26,35.56 | SW_L.3 100.28,10.21 100.33,10.16 100.33,22.86 | 100.33,22.86 100.33,35.56 | 100.33,35.56 100.33,48.26 100.28,48.31 SW_I.3 | SW_J.3 100.28,35.61 100.33,35.56 | SW_K.3 100.28,22.91 100.33,22.86
KEY_SCAN2  (18 unrouted)
  Bottom 0.406: SW_1.4 9.88,69.83 10.16,70.1 14.48,70.1 16.51,68.07 18.09,68.07 SW_2.4 18.14,69.83 18.16,69.85 22.86,69.85 24.69,68.02 SW_3.4 26.39,70.08 26.42,70.1 30.99,70.1 33.02,68.07 34.59,68.07 SW_4.4 34.65,69.95 34.8,70.1 39.24,70.1 41.33,68.02 SW_5.4 42.9,70.08 42.93,70.1 47.37,70.1 49.53,67.94 51.08,67.94 | 51.08,67.94 SW_6.4 | 51.08,67.94 51.08,70 51.18,70.1 55.5,70.1 57.53,68.07 59.36,68.07 SW_7.4 59.41,69.7 59.69,69.98 63.88,69.98 65.91,67.94 67.59,67.94 | 67.59,67.94 SW_8.4 | 67.59,67.94 67.59,69.88 67.69,69.98 72.39,69.98 74.42,67.94 75.84,67.94 | 75.84,67.94 SW_9.4 | 75.84,67.94 75.84,69.88 75.95,69.98 80.64,69.98 82.55,68.07 84.12,68.07 SW_10.4 84.18,69.95 84.2,69.98 88.65,69.98 90.68,67.94 92.35,67.94 | 92.35,67.94 SW_11.4 | 92.35,67.94 92.35,69.88 92.46,69.98 96.9,69.98 98.93,67.94 100.61,67.94 | 100.61,67.94 SW_12.4 | 100.61,67.94 100.61,69.88 100.84,70.1 105.28,70.1 107.44,67.94 108.86,67.94 | 108.86,67.94 SW_13.4 | 108.86,67.94 108.86,70 108.97,70.1 113.41,70.1 115.57,67.94 117.12,67.94 | 117.12,67.94 SW_14.4 | 117.12,67.94 117.12,70 117.22,70.1 121.54,70.1 123.7,67.94 125.37,67.94 | 125.37,67.94 SW_15.4 | 125.37,67.94 125.37,70 125.48,70.1 130.18,70.1 132.33,67.94 133.63,67.94 SW_16.4
LED_BEAT
  Top 0.406: R15.1 LED_BEAT.A
LED_HOLD  (1 unrouted)
LED_RX
  Top 0.406: LED_RX.A R14.2
LED_TX
  Top 0.406: LED_TX.A R16.2
LEDS_ENABLE
  Top 0.406: LED_13.K 106.68,77.05 R18.2 | LED_11.K 90.17,81.28 88.9,82.55 R1.1
  Bottom 0.406: LED_1.K LED_2.K LED_3.K LED_4.K LED_5.K LED_6.K LED_7.K LED_8.K LED_9.K LED_10.K LED_11.K LED_12.K LED_13.K LED_14.K LED_15.K LED_16.K
MOSI  (1 unrouted)
N$1
  Top 0.406: LED4.A R24.2
N$4
  Top 0.406: R11.1 99.13,78.32 TR1.B
N$5
  Bottom 0.813: U$3.P$2 123.19,80.01 123.19,85.09 120.65,87.63 112.51,87.63 U$2.RING
N$6
  Top 0.406: R15.2 81.28,92.71 80.77,92.2 80.77,78.23 85.47,73.53 85.47,46.48 82.8,43.81 IC1.25
N$9  (1 unrouted)
N$10
  Top 0.813: U$3.P$5 113.03,78.74 111.66,80.11 U$2.TIP 111.26,81.28 109.22,81.28 107.95,82.55 107.95,91.44 109.22,92.71 BATT-.1
N$14
  Top 0.406: TR1.C R18.1
N$15
  Top 0.813: R8.1 ICSP1.4
N$17  (2 unrouted)
  Top 0.406: IC6.15 27.56,39.37 25.02,41.91 16.56,41.91 SW_A.1 | SW_1.2 5.36,68.86 LED_1.A
  Bottom 0.406: SW_A.1 5.18,61.34 SW_1.1
N$19
  Top 0.813: U$2.RING_SW 116.9,83.88 118.11,85.09 BATT+.1
N$20  (2 unrouted)
  Top 0.406: SW_B.2 22.28,40.59 IC6.1 | SW_2.2 13.61,68.86 LED_2.A
  Bottom 0.406: SW_B.1 6.3,40.59 7.62,41.91 7.62,54.74 6.73,55.63 6.73,65.53 7.24,66.04 12.7,66.04 13.59,66.93 13.59,68 SW_2.2
N$21  (2 unrouted)
  Top 0.406: IC6.2 20.32,39.37 19.05,38.1 15.52,38.1 SW_C.1 | SW_3.2 21.87,68.86 LED_3.A
  Bottom 0.406: SW_C.1 6.3,27.89 8.38,30.48 8.38,54.99 7.37,56.01 7.37,65.02 7.75,65.41 13.08,65.41 13.59,65.91 19.76,65.91 SW_3.2
N$22  (2 unrouted)
  Top 0.406: IC6.3 20.32,38.1 19.56,37.34 15.88,37.34 9.27,30.73 9.27,18.16 6.35,15.24 5.23,15.24 SW_D.1 | SW_4.2 30.12,68.86 LED_4.A
  Bottom 0.406: SW_D.1 6.3,15.19 9.27,18.16 9.27,55.12 8.13,56.26 8.13,64.64 8.25,64.77 13.59,64.77 14.1,65.28 20.14,65.28 20.65,65.79 27.43,65.79 29.67,68.02 SW_4.2
N$23  (via drill 0.6)  (2 unrouted)
  Top 0.406: IC6.4 21.59,36.83 20.32,35.56 20.32,34.8 19.81,34.29 13.97,34.29 13.46,33.78 v12.83,29.34 | SW_5.2 38.38,68.86 LED_5.A
  Bottom 0.406: SW_5.2 38.38,66.32 37.85,65.79 28.45,65.79 27.81,65.15 21.21,65.15 20.7,64.64 14.48,64.64 13.97,64.14 11.3,64.14 11.3,58.17 12.83,56.01 v12.83,29.34 | SW_E.1 49.58,53.29 46.99,55.88 39.88,55.88 38.35,57.4 38.35,61.49 SW_5.1
N$24  (via drill 0.6)  (2 unrouted)
  Top 0.406: IC6.5 21.34,35.56 21.08,35.31 21.08,34.42 20.32,33.66 14.99,33.66 14.61,33.27 v14.61,29.97 | SW_6.2 46.63,68.86 LED_6.A
  Bottom 0.406: SW_6.2 44.65,66.04 39.12,66.04 38.23,65.15 28.83,65.15 28.19,64.52 21.72,64.52 21.21,64.01 15.11,64.01 14.99,63.88 14.99,60.07 13.59,58.67 13.59,30.48 v14.61,29.97 | SW_F.1 51.77,40.59 53.85,42.67 53.85,53.98 52.45,55.37 48.51,55.37 46.61,57.28 46.61,61.49 SW_6.1
N$25  (via drill 0.6)  (3 unrouted)
  Top 0.406: IC6.6 21.97,34.29 20.7,33.02 16.51,33.02 16,32.51 v16,29.97 | SW_7.2 54.89,68.86 LED_7.A
  Bottom 0.406: 54.89,65.43 54.86,65.41 | SW_7.2 54.89,66.95 53.34,65.41 39.62,65.41 38.73,64.52 29.34,64.52 28.7,63.88 23.88,63.88 23.37,63.37 23.37,60.07 22.61,59.31 15.37,59.31 14.35,58.29 14.35,31.11 v16,29.97 | SW_G.1 52.78,27.89 54.86,30.48 54.86,61.49 SW_7.1
N$26  (via drill 0.6)  (2 unrouted)
  Top 0.406: IC6.7 21.84,33.02 21.21,32.38 17.78,32.38 17.53,32.13 17.53,29.97 v17.4,29.84 | SW_8.2 63.14,68.86 LED_8.A
  Bottom 0.406: SW_8.2 63.14,65.68 62.23,64.77 40.13,64.77 39.24,63.88 29.84,63.88 29.21,63.25 28.58,63.25 28.19,62.87 28.19,59.44 27.18,58.42 15.62,58.42 15.11,57.91 15.11,31.62 16.64,30.61 v17.4,29.84 | SW_8.1 63.14,59.97 59.05,55.88 59.05,26.16 50.93,18.03 50.93,15.21 SW_H.1
N$27  (2 unrouted)
  Top 0.406: SW_9.2 71.4,68.86 LED_9.A | IC7.15 123.7,53.98 121.28,56.39 112.22,56.39 SW_I.2
  Bottom 0.406: SW_9.1 71.4,65.3 72.01,65.91 106.93,65.91 107.7,65.15 107.7,54.71 SW_I.2 109.04,53.21 107.57,53.21
N$28  (2 unrouted)
  Top 0.406: SW_10.2 79.65,68.86 LED_10.A | IC7.1 113.66,55.24 111.76,53.34 111.76,43.23 SW_J.2
  Bottom 0.406: SW_10.1 79.65,65.05 79.88,65.28 106.55,65.28 107.06,64.77 107.06,54.86 105.92,53.72 105.92,42.16 107.44,40.64 109.07,40.64 SW_J.2
N$29  (2 unrouted)
  Top 0.406: SW_12.2 96.16,68.86 LED_12.A | IC7.3 113.92,52.7 113.03,51.82 113.03,42.67 112.27,41.91 112.27,18.34 SW_L.2
  Bottom 0.406: SW_12.1 96.16,63.65 96.39,63.88 105.79,63.88 105.79,55.75 104.14,54.1 104.14,20.17 SW_L.2
N$30  (2 unrouted)
  Top 0.406: SW_11.2 87.91,68.86 LED_11.A | IC7.2 114.17,53.98 112.39,52.2 112.39,42.93 111.63,42.16 111.63,30.53 SW_K.2
  Bottom 0.406: SW_11.1 87.91,64.41 88.14,64.64 106.17,64.64 106.43,64.39 106.43,55.24 105.16,53.98 105.16,30.73 107.95,27.94 109.07,27.94 SW_K.2
N$31  (1 unrouted)
N$32  (via drill 0.6)  (1 unrouted)
  Top 0.406: SW_13.2 104.42,68.86 LED_13.A | v114.3,51.44 IC7.4 | v114.3,57.15 105.41,57.15 104.39,58.17 104.39,61.49 SW_13.1
  Bottom 0.406: v114.3,57.15 v114.3,51.44
N$33
  Top 0.406: R19.2 LED_POWER1.A
N$34  (via drill 0.6)  (1 unrouted)
  Top 0.406: SW_14.2 112.67,68.86 LED_14.A | v115.44,50.16 IC7.5 | SW_14.1 112.65,61.49 112.65,60.58 v115.44,57.78
  Bottom 0.406: v115.44,50.16 v115.44,57.78
N$35
  Top 0.406: R16.1 77.98,87.63 78.36,87.25 78.36,80.64 77.72,80.01 77.72,71.5 77.47,71.25 77.47,50.8 78.74,49.53 81.28,49.53 82.01,48.8 IC1.26
N$36
  Top 0.406: IC1.8 72.13,35.3 71.12,34.29 X1.2 70.04,30.8 C6.1
N$37
  Top 0.406: IC1.7 71.72,36.1 X1.1 70.04,37.78 C5.1
N$38  (5 unrouted)
N$39  (via drill 0.6)  (2 unrouted)
  Top 0.406: SW_15.2 120.93,68.86 LED_15.A | v116.84,48.9 IC7.6 | v116.84,58.42 119.38,58.42 120.9,59.94 120.9,61.49
  Bottom 0.406: v116.84,48.9 v116.84,58.42
N$40  (via drill 0.6)  (1 unrouted)
  Top 0.406: SW_16.2 129.18,68.86 LED_16.A | v118.11,47.62 IC7.7 | v118.11,57.78 119.89,57.78 121.54,59.44 127.1,59.44 SW_16.1
  Bottom 0.406: v118.11,47.62 v118.11,57.78
N$41
  Top 0.813: U$3.P$4 123.19,77.47 123.19,85.09 124.46,86.36 D4.A
  Bottom 0.813: D4.A D3.C
N$43  (1 unrouted)
  Top 0.406: R11.2 93.98,72.39 90.17,68.58 90.17,58.42
N$44  (1 unrouted)
  Top 0.406: R14.1 78.36,92.71 78.99,92.08 78.99,80.26 78.49,79.76 78.49,71.25 78.11,70.87 78.11,50.8
N$45
  Bottom 0.813: U$3.P$3 125.73,76.2 D6.A D5.C
N$46  (via drill 0.6)
  Top 0.406: v85.09,77.47 87.31,77.47 R207.2
  Bottom 0.406: MIDI_OUT.4 62.23,77.47 v85.09,77.47
N$47
  Top 0.406: R201.2 26.35,47.94 25.4,46.99 20.32,46.99 20.32,49.53 21.59,50.8 OK1.7
N$48
  Top 0.406: MIDI_OUT.5 50.8,82.55 52.07,83.82 66.04,83.82 67.31,82.55 R206.1
N$49
  Top 0.406: OK2.7 35.56,50.8 34.29,49.53 34.29,46.99 39.37,46.99 40.64,48.26 41.59,48.26 R204.2
N$50  (1 unrouted)
N$55  (1 unrouted)
N$56
  Top 0.406: OK2.2 43.18,50.8 42.67,51.31 42.67,55.63 | 42.67,55.63 42.67,56.82 D8.1 | R203.1 42.86,55.44 42.67,55.63
N$57
  Top 0.406: OK2.3 41.91,50.8 41.91,53.34 39.37,55.88 39.37,56.72 D8.2 36.83,57.15 35.94,58.04 35.94,76.83 34.04,78.74 SYNCH_IN.5
N$58  (1 unrouted)
  Top 0.406: R24.1 77.05,71.97 73.66,68.58 73.66,48.26
N$59  (via drill 0.6)
  Top 0.406: v34.29,29.72 J1.1 | v34.29,17.14 IC9.4
  Bottom 0.406: v34.29,29.72 33.66,29.08 33.66,17.78 v34.29,17.14
N$60
  Top 0.406: OK1.3 27.94,50.8 27.94,53.09 25.02,56.01 25.02,57.1 D7.2 20.45,57.15 19.56,58.04 19.56,76.58 17.4,78.74 MIDI_IN.5
N$61
  Top 0.406: OK1.2 29.34,50.8 28.7,51.44 28.7,55.75 | 28.7,55.75 28.7,56.82 D7.1 | R200.1 28.89,55.56 28.7,55.75
N$62
  Top 0.406: MIDI_IN.4 21.59,77.98 20.19,76.58 20.19,59.69 20.7,59.18 32,59.18 32.51,58.67 32.51,57.59 R200.2
N$63
  Top 0.406: SYNCH_IN.4 38.48,78.74 36.58,76.83 36.58,59.69 37.08,59.18 45.85,59.18 46.35,58.67 R203.2
SCK  (2 unrouted)
SERIAL_RX  (2 unrouted)
  Top 0.406: OK1.6 24.13,48.26 25.4,49.53 R202.2
SERIAL_TX  (2 unrouted)
SR_CLK  (4 unrouted)
SR_DAT  (1 unrouted)
SW_HOLD  (3 unrouted)
SYNCH_RESTART  (via drill 0.6)  (1 unrouted)
  Top 0.406: v44.45,18.41 IC9.6 | v36.83,27.18 36.96,27.43 38.48,27.43 J1.5
  Bottom 0.406: v44.45,18.41 35.05,18.41 34.42,19.05 34.42,26.67 34.92,27.18 v36.83,27.18
SYNCH_RUN  (1 unrouted)
  Top 0.406: IC9.7 43.18,19.68 44.45,20.95 44.45,26.67 42.67,28.45 J1.4
SYNCH_RX  (via drill 0.6)
  Top 0.406: OK2.6 38.1,48.26 39.37,49.53 R205.2 | v30.35,19.68 IC9.2
  Bottom 0.406: OK2.6 34.67,48.26 33.15,46.74 33.15,44.58 30.48,41.91 30.48,19.81 v30.35,19.68
SYNCH_TICK  (1 unrouted)
VCC  (via drill 0.6)  (6 unrouted)
  Top 0.406: R205.1 39.05,53.34 OK2.8 35.56,53.34 33.15,50.93 33.15,41.78 32,40.64 IC6.16 v28.58,40.64 | 37.34,22.86 C12.1 | 37.34,22.86 36.83,22.35 36.83,21.03 IC9.1 | v41.91,29.72 J1.2 | v35.56,22.86 37.34,22.86 | C11.1 128.2,55.24 IC7.16 v124.21,55.24 | v124.21,47.62 IC7.10 | C10.1 29.84,42.55 30.48,41.91 30.48,40.64 | R19.1 R1.2 82.97,80.86 | R207.1 84.14,79.69 82.97,80.86 | 82.97,80.86 82.93,80.9 82.93,77.09 86.23,73.79 86.23,58.17 | IC6.10 v28.58,33.02 28.58,22.99 28.45,22.86 | 78.74,0 R8.2 | IC1.6 79.94,36.9 80.01,36.83 | IC1.18 80.74,36.1 80.01,36.83 | 80.88,37.7 IC1.20 86.28,37.7 C3.1 | 80.01,36.83 80.88,37.7 | IC1.4 80.08,38.5 80.88,37.7 | OK1.8 25.08,53.34 R202.1 25.4,53.34 OK1.8
  Top 0.813: IC2.3 127,24.13 127,26.35 C15.1 126.68,28.51 126.62,28.57 | 126.62,28.57 C4.+ | 126.62,28.57 126.62,23.75 IC2.3 | IC2.3 125.73,17.78 107.95,0 78.74,0 26.67,0 25.4,1.27 25.4,21.59 26.67,22.86 28.45,22.86 v35.56,22.86
  Bottom 0.406: v41.91,29.72 41.91,25.4 40.64,24.13 35.94,24.13 35.56,23.75 v35.56,22.86 | OK2.8 OK1.8 | v124.21,47.62 v124.21,55.24 | v28.58,33.02 v28.58,40.64
  other vias: 22.86,53.34
VIN1
  Top 0.813: D6.C 134.62,78.74 135.89,77.47 135.89,35.56 134.62,34.29 125.73,34.29 123.19,31.75 123.19,30.48 121.92,29.21 120.9,29.21 C13.+ 119.7,28.51 C14.1 119.38,26.35 119.38,24.13 IC2.1
  Bottom 0.813: D6.C 132.84,78.74 133.73,79.63 133.73,85.6 132.97,86.36 D4.C